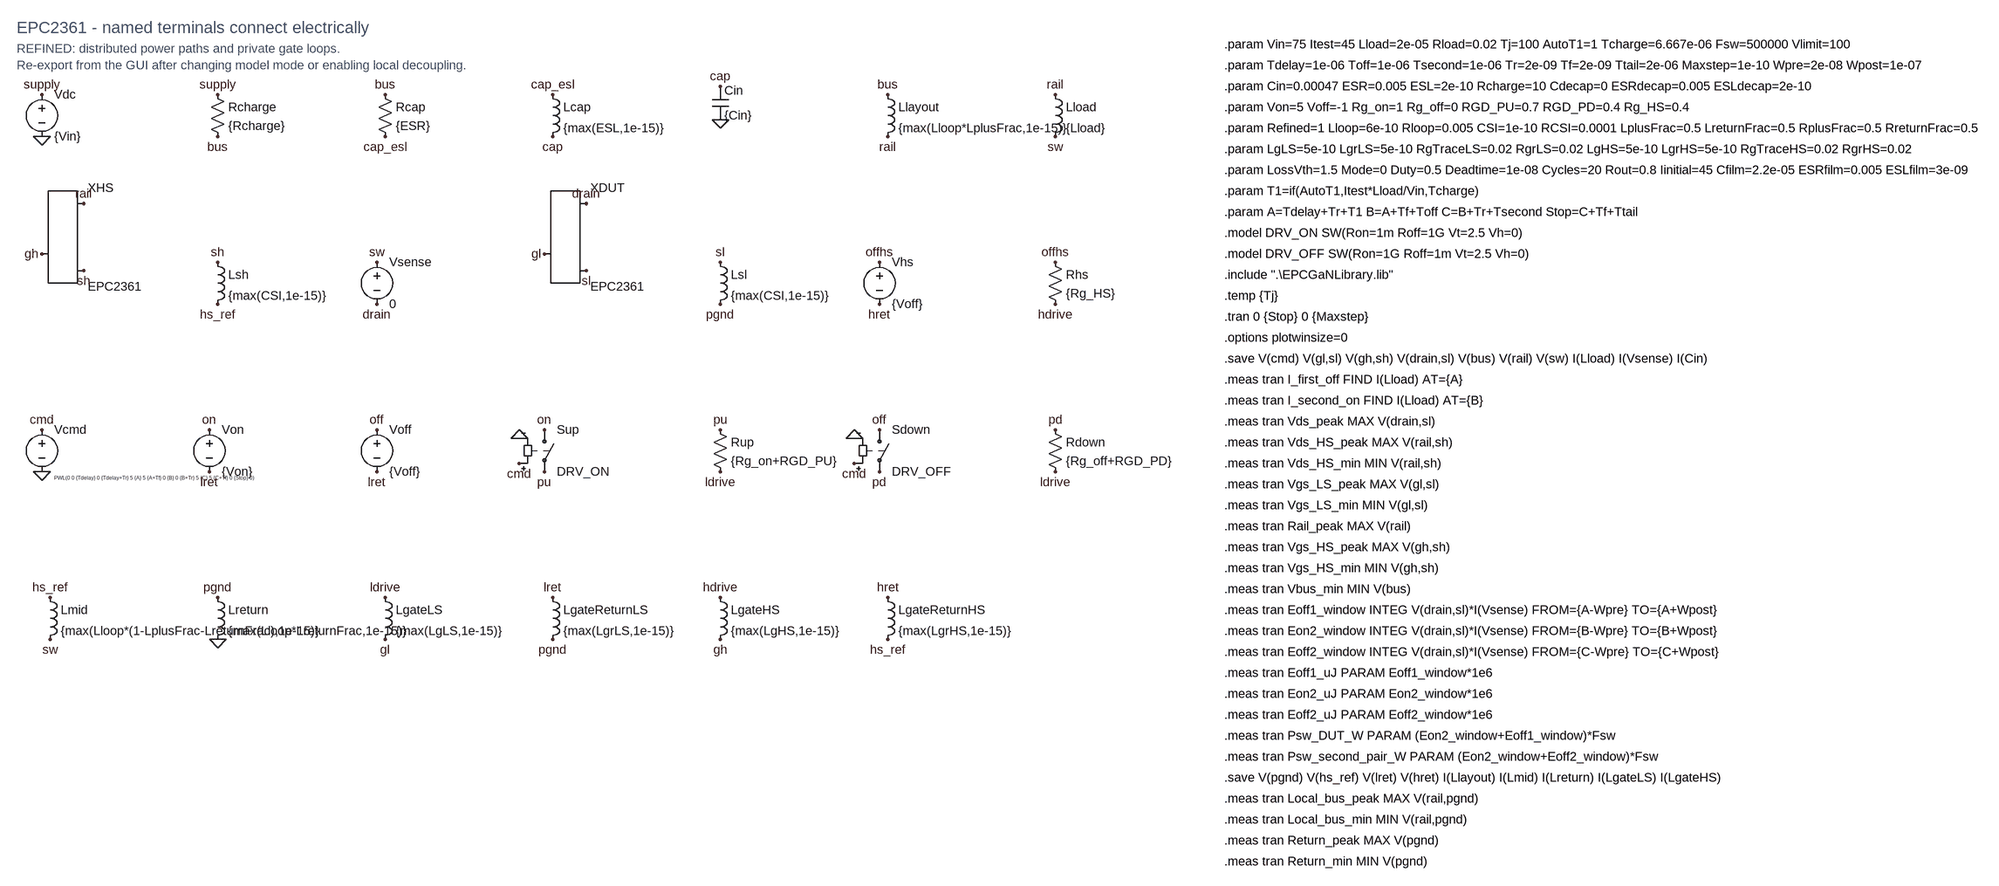
[diagram p0: schematic DPT-EPC.asc]
DPT-EPC.asc, the LTspice schematic file:
Version 4
SHEET 1 4400 2100
TEXT 48 0 Left 3 ;EPC2361 - named terminals connect electrically
TEXT 48 40 Left 2 ;REFINED: distributed power paths and private gate loops.
TEXT 48 72 Left 2 ;Re-export from the GUI after changing model mode or enabling local decoupling.
SYMBOL voltage 96 112 R0
SYMATTR InstName Vdc
SYMATTR Value {Vin}
FLAG 96 128 supply
FLAG 96 208 0
SYMBOL res 416 112 R0
SYMATTR InstName Rcharge
SYMATTR Value {Rcharge}
FLAG 432 128 supply
FLAG 432 208 bus
SYMBOL res 736 112 R0
SYMATTR InstName Rcap
SYMATTR Value {ESR}
FLAG 752 128 bus
FLAG 752 208 cap_esl
SYMBOL ind 1056 112 R0
SYMATTR InstName Lcap
SYMATTR Value {max(ESL,1e-15)}
SYMATTR SpiceLine Rser=0
FLAG 1072 128 cap_esl
FLAG 1072 208 cap
SYMBOL cap 1376 112 R0
SYMATTR InstName Cin
SYMATTR Value {Cin}
FLAG 1392 112 cap
FLAG 1392 176 0
SYMBOL ind 1696 112 R0
SYMATTR InstName Llayout
SYMATTR Value {max(Lloop*LplusFrac,1e-15)}
SYMATTR SpiceLine Rser={Rloop*RplusFrac}
FLAG 1712 128 bus
FLAG 1712 208 rail
SYMBOL ind 2016 112 R0
SYMATTR InstName Lload
SYMATTR Value {Lload}
SYMATTR SpiceLine Rser={Rload}
FLAG 2032 128 rail
FLAG 2032 208 sw
SYMBOL EPCGaN 96 432 R0
SYMATTR InstName XHS
SYMATTR Value EPC2361
SYMATTR ModelFile .\EPCGaNLibrary.lib
FLAG 96 432 gh
FLAG 176 336 rail
FLAG 176 464 sh
SYMBOL ind 416 432 R0
SYMATTR InstName Lsh
SYMATTR Value {max(CSI,1e-15)}
SYMATTR SpiceLine Rser={RCSI}
FLAG 432 448 sh
FLAG 432 528 hs_ref
SYMBOL voltage 736 432 R0
SYMATTR InstName Vsense
SYMATTR Value 0
FLAG 736 448 sw
FLAG 736 528 drain
SYMBOL EPCGaN 1056 432 R0
SYMATTR InstName XDUT
SYMATTR Value EPC2361
SYMATTR ModelFile .\EPCGaNLibrary.lib
FLAG 1056 432 gl
FLAG 1136 336 drain
FLAG 1136 464 sl
SYMBOL ind 1376 432 R0
SYMATTR InstName Lsl
SYMATTR Value {max(CSI,1e-15)}
SYMATTR SpiceLine Rser={RCSI}
FLAG 1392 448 sl
FLAG 1392 528 pgnd
SYMBOL voltage 1696 432 R0
SYMATTR InstName Vhs
SYMATTR Value {Voff}
FLAG 1696 448 offhs
FLAG 1696 528 hret
SYMBOL res 2016 432 R0
SYMATTR InstName Rhs
SYMATTR Value {Rg_HS}
FLAG 2032 448 offhs
FLAG 2032 528 hdrive
SYMBOL voltage 96 752 R0
WINDOW 3 24 108 Left 0
SYMATTR InstName Vcmd
SYMATTR Value PWL(0 0 {Tdelay} 0 {Tdelay+Tr} 5 {A} 5 {A+Tf} 0 {B} 0 {B+Tr} 5 {C} 5 {C+Tf} 0 {Stop} 0)
FLAG 96 768 cmd
FLAG 96 848 0
SYMBOL voltage 416 752 R0
SYMATTR InstName Von
SYMATTR Value {Von}
FLAG 416 768 on
FLAG 416 848 lret
SYMBOL voltage 736 752 R0
SYMATTR InstName Voff
SYMATTR Value {Voff}
FLAG 736 768 off
FLAG 736 848 lret
SYMBOL sw 1056 752 R0
SYMATTR InstName Sup
SYMATTR Value DRV_ON
FLAG 1056 768 on
FLAG 1056 848 pu
FLAG 1008 832 cmd
FLAG 1008 784 0
SYMBOL res 1376 752 R0
SYMATTR InstName Rup
SYMATTR Value {Rg_on+RGD_PU}
FLAG 1392 768 pu
FLAG 1392 848 ldrive
SYMBOL sw 1696 752 R0
SYMATTR InstName Sdown
SYMATTR Value DRV_OFF
FLAG 1696 768 off
FLAG 1696 848 pd
FLAG 1648 832 cmd
FLAG 1648 784 0
SYMBOL res 2016 752 R0
SYMATTR InstName Rdown
SYMATTR Value {Rg_off+RGD_PD}
FLAG 2032 768 pd
FLAG 2032 848 ldrive
SYMBOL ind 96 1072 R0
SYMATTR InstName Lmid
SYMATTR Value {max(Lloop*(1-LplusFrac-LreturnFrac),1e-15)}
SYMATTR SpiceLine Rser={Rloop*max(1-RplusFrac-RreturnFrac,0)}
FLAG 112 1088 hs_ref
FLAG 112 1168 sw
SYMBOL ind 416 1072 R0
SYMATTR InstName Lreturn
SYMATTR Value {max(Lloop*LreturnFrac,1e-15)}
SYMATTR SpiceLine Rser={Rloop*RreturnFrac}
FLAG 432 1088 pgnd
FLAG 432 1168 0
SYMBOL ind 736 1072 R0
SYMATTR InstName LgateLS
SYMATTR Value {max(LgLS,1e-15)}
SYMATTR SpiceLine Rser={RgTraceLS}
FLAG 752 1088 ldrive
FLAG 752 1168 gl
SYMBOL ind 1056 1072 R0
SYMATTR InstName LgateReturnLS
SYMATTR Value {max(LgrLS,1e-15)}
SYMATTR SpiceLine Rser={RgrLS}
FLAG 1072 1088 lret
FLAG 1072 1168 pgnd
SYMBOL ind 1376 1072 R0
SYMATTR InstName LgateHS
SYMATTR Value {max(LgHS,1e-15)}
SYMATTR SpiceLine Rser={RgTraceHS}
FLAG 1392 1088 hdrive
FLAG 1392 1168 gh
SYMBOL ind 1696 1072 R0
SYMATTR InstName LgateReturnHS
SYMATTR Value {max(LgrHS,1e-15)}
SYMATTR SpiceLine Rser={RgrHS}
FLAG 1712 1088 hret
FLAG 1712 1168 hs_ref
TEXT 2440 32 Left 2 !.param Vin=75 Itest=45 Lload=2e-05 Rload=0.02 Tj=100 AutoT1=1 Tcharge=6.667e-06 Fsw=500000 Vlimit=100
TEXT 2440 72 Left 2 !.param Tdelay=1e-06 Toff=1e-06 Tsecond=1e-06 Tr=2e-09 Tf=2e-09 Ttail=2e-06 Maxstep=1e-10 Wpre=2e-08 Wpost=1e-07
TEXT 2440 112 Left 2 !.param Cin=0.00047 ESR=0.005 ESL=2e-10 Rcharge=10 Cdecap=0 ESRdecap=0.005 ESLdecap=2e-10
TEXT 2440 152 Left 2 !.param Von=5 Voff=-1 Rg_on=1 Rg_off=0 RGD_PU=0.7 RGD_PD=0.4 Rg_HS=0.4
TEXT 2440 192 Left 2 !.param Refined=1 Lloop=6e-10 Rloop=0.005 CSI=1e-10 RCSI=0.0001 LplusFrac=0.5 LreturnFrac=0.5 RplusFrac=0.5 RreturnFrac=0.5
TEXT 2440 232 Left 2 !.param LgLS=5e-10 LgrLS=5e-10 RgTraceLS=0.02 RgrLS=0.02 LgHS=5e-10 LgrHS=5e-10 RgTraceHS=0.02 RgrHS=0.02
TEXT 2440 272 Left 2 !.param LossVth=1.5 Mode=0 Duty=0.5 Deadtime=1e-08 Cycles=20 Rout=0.8 Iinitial=45 Cfilm=2.2e-05 ESRfilm=0.005 ESLfilm=3e-09
TEXT 2440 312 Left 2 !.param T1=if(AutoT1,Itest*Lload/Vin,Tcharge)
TEXT 2440 352 Left 2 !.param A=Tdelay+Tr+T1 B=A+Tf+Toff C=B+Tr+Tsecond Stop=C+Tf+Ttail
TEXT 2440 392 Left 2 !.model DRV_ON SW(Ron=1m Roff=1G Vt=2.5 Vh=0)
TEXT 2440 432 Left 2 !.model DRV_OFF SW(Ron=1G Roff=1m Vt=2.5 Vh=0)
TEXT 2440 472 Left 2 !.include ".\EPCGaNLibrary.lib"
TEXT 2440 512 Left 2 !.temp {Tj}
TEXT 2440 552 Left 2 !.tran 0 {Stop} 0 {Maxstep}
TEXT 2440 592 Left 2 !.options plotwinsize=0
TEXT 2440 632 Left 2 !.save V(cmd) V(gl,sl) V(gh,sh) V(drain,sl) V(bus) V(rail) V(sw) I(Lload) I(Vsense) I(Cin)
TEXT 2440 672 Left 2 !.meas tran I_first_off FIND I(Lload) AT={A}
TEXT 2440 712 Left 2 !.meas tran I_second_on FIND I(Lload) AT={B}
TEXT 2440 752 Left 2 !.meas tran Vds_peak MAX V(drain,sl)
TEXT 2440 792 Left 2 !.meas tran Vds_HS_peak MAX V(rail,sh)
TEXT 2440 832 Left 2 !.meas tran Vds_HS_min MIN V(rail,sh)
TEXT 2440 872 Left 2 !.meas tran Vgs_LS_peak MAX V(gl,sl)
TEXT 2440 912 Left 2 !.meas tran Vgs_LS_min MIN V(gl,sl)
TEXT 2440 952 Left 2 !.meas tran Rail_peak MAX V(rail)
TEXT 2440 992 Left 2 !.meas tran Vgs_HS_peak MAX V(gh,sh)
TEXT 2440 1032 Left 2 !.meas tran Vgs_HS_min MIN V(gh,sh)
TEXT 2440 1072 Left 2 !.meas tran Vbus_min MIN V(bus)
TEXT 2440 1112 Left 2 !.meas tran Eoff1_window INTEG V(drain,sl)*I(Vsense) FROM={A-Wpre} TO={A+Wpost}
TEXT 2440 1152 Left 2 !.meas tran Eon2_window INTEG V(drain,sl)*I(Vsense) FROM={B-Wpre} TO={B+Wpost}
TEXT 2440 1192 Left 2 !.meas tran Eoff2_window INTEG V(drain,sl)*I(Vsense) FROM={C-Wpre} TO={C+Wpost}
TEXT 2440 1232 Left 2 !.meas tran Eoff1_uJ PARAM Eoff1_window*1e6
TEXT 2440 1272 Left 2 !.meas tran Eon2_uJ PARAM Eon2_window*1e6
TEXT 2440 1312 Left 2 !.meas tran Eoff2_uJ PARAM Eoff2_window*1e6
TEXT 2440 1352 Left 2 !.meas tran Psw_DUT_W PARAM (Eon2_window+Eoff1_window)*Fsw
TEXT 2440 1392 Left 2 !.meas tran Psw_second_pair_W PARAM (Eon2_window+Eoff2_window)*Fsw
TEXT 2440 1432 Left 2 !.save V(pgnd) V(hs_ref) V(lret) V(hret) I(Llayout) I(Lmid) I(Lreturn) I(LgateLS) I(LgateHS)
TEXT 2440 1472 Left 2 !.meas tran Local_bus_peak MAX V(rail,pgnd)
TEXT 2440 1512 Left 2 !.meas tran Local_bus_min MIN V(rail,pgnd)
TEXT 2440 1552 Left 2 !.meas tran Return_peak MAX V(pgnd)
TEXT 2440 1592 Left 2 !.meas tran Return_min MIN V(pgnd)

The netlist it stands for:
* DPT-EPC.asc
Vdc supply 0 {Vin}
Rcharge supply bus {Rcharge}
Rcap bus cap_esl {ESR}
Lcap cap_esl cap {max(ESL,1e-15)} Rser=0
Cin cap 0 {Cin}
Llayout bus rail {max(Lloop*LplusFrac,1e-15)} Rser={Rloop*RplusFrac}
Lload rail sw {Lload} Rser={Rload}
XXHS gh rail sh EPC2361
Lsh sh hs_ref {max(CSI,1e-15)} Rser={RCSI}
Vsense sw drain 0
XXDUT gl drain sl EPC2361
Lsl sl pgnd {max(CSI,1e-15)} Rser={RCSI}
Vhs offhs hret {Voff}
Rhs offhs hdrive {Rg_HS}
Vcmd cmd 0 PWL(0 0 {Tdelay} 0 {Tdelay+Tr} 5 {A} 5 {A+Tf} 0 {B} 0 {B+Tr} 5 {C} 5 {C+Tf} 0 {Stop} 0)
Von on lret {Von}
Voff off lret {Voff}
Sup on pu cmd 0 DRV_ON
Rup pu ldrive {Rg_on+RGD_PU}
Sdown off pd cmd 0 DRV_OFF
Rdown pd ldrive {Rg_off+RGD_PD}
Lmid hs_ref sw {max(Lloop*(1-LplusFrac-LreturnFrac),1e-15)} Rser={Rloop*max(1-RplusFrac-RreturnFrac,0)}
Lreturn pgnd 0 {max(Lloop*LreturnFrac,1e-15)} Rser={Rloop*RreturnFrac}
LgateLS ldrive gl {max(LgLS,1e-15)} Rser={RgTraceLS}
LgateReturnLS lret pgnd {max(LgrLS,1e-15)} Rser={RgrLS}
LgateHS hdrive gh {max(LgHS,1e-15)} Rser={RgTraceHS}
LgateReturnHS hret hs_ref {max(LgrHS,1e-15)} Rser={RgrHS}
* EPC2361 - named terminals connect electrically
* REFINED: distributed power paths and private gate loops.
* Re-export from the GUI after changing model mode or enabling local decoupling.
.param Vin=75 Itest=45 Lload=2e-05 Rload=0.02 Tj=100 AutoT1=1 Tcharge=6.667e-06 Fsw=500000 Vlimit=100
.param Tdelay=1e-06 Toff=1e-06 Tsecond=1e-06 Tr=2e-09 Tf=2e-09 Ttail=2e-06 Maxstep=1e-10 Wpre=2e-08 Wpost=1e-07
.param Cin=0.00047 ESR=0.005 ESL=2e-10 Rcharge=10 Cdecap=0 ESRdecap=0.005 ESLdecap=2e-10
.param Von=5 Voff=-1 Rg_on=1 Rg_off=0 RGD_PU=0.7 RGD_PD=0.4 Rg_HS=0.4
.param Refined=1 Lloop=6e-10 Rloop=0.005 CSI=1e-10 RCSI=0.0001 LplusFrac=0.5 LreturnFrac=0.5 RplusFrac=0.5 RreturnFrac=0.5
.param LgLS=5e-10 LgrLS=5e-10 RgTraceLS=0.02 RgrLS=0.02 LgHS=5e-10 LgrHS=5e-10 RgTraceHS=0.02 RgrHS=0.02
.param LossVth=1.5 Mode=0 Duty=0.5 Deadtime=1e-08 Cycles=20 Rout=0.8 Iinitial=45 Cfilm=2.2e-05 ESRfilm=0.005 ESLfilm=3e-09
.param T1=if(AutoT1,Itest*Lload/Vin,Tcharge)
.param A=Tdelay+Tr+T1 B=A+Tf+Toff C=B+Tr+Tsecond Stop=C+Tf+Ttail
.model DRV_ON SW(Ron=1m Roff=1G Vt=2.5 Vh=0)
.model DRV_OFF SW(Ron=1G Roff=1m Vt=2.5 Vh=0)
.include ".\EPCGaNLibrary.lib"
.temp {Tj}
.tran 0 {Stop} 0 {Maxstep}
.options plotwinsize=0
.save V(cmd) V(gl,sl) V(gh,sh) V(drain,sl) V(bus) V(rail) V(sw) I(Lload) I(Vsense) I(Cin)
.meas tran I_first_off FIND I(Lload) AT={A}
.meas tran I_second_on FIND I(Lload) AT={B}
.meas tran Vds_peak MAX V(drain,sl)
.meas tran Vds_HS_peak MAX V(rail,sh)
.meas tran Vds_HS_min MIN V(rail,sh)
.meas tran Vgs_LS_peak MAX V(gl,sl)
.meas tran Vgs_LS_min MIN V(gl,sl)
.meas tran Rail_peak MAX V(rail)
.meas tran Vgs_HS_peak MAX V(gh,sh)
.meas tran Vgs_HS_min MIN V(gh,sh)
.meas tran Vbus_min MIN V(bus)
.meas tran Eoff1_window INTEG V(drain,sl)*I(Vsense) FROM={A-Wpre} TO={A+Wpost}
.meas tran Eon2_window INTEG V(drain,sl)*I(Vsense) FROM={B-Wpre} TO={B+Wpost}
.meas tran Eoff2_window INTEG V(drain,sl)*I(Vsense) FROM={C-Wpre} TO={C+Wpost}
.meas tran Eoff1_uJ PARAM Eoff1_window*1e6
.meas tran Eon2_uJ PARAM Eon2_window*1e6
.meas tran Eoff2_uJ PARAM Eoff2_window*1e6
.meas tran Psw_DUT_W PARAM (Eon2_window+Eoff1_window)*Fsw
.meas tran Psw_second_pair_W PARAM (Eon2_window+Eoff2_window)*Fsw
.save V(pgnd) V(hs_ref) V(lret) V(hret) I(Llayout) I(Lmid) I(Lreturn) I(LgateLS) I(LgateHS)
.meas tran Local_bus_peak MAX V(rail,pgnd)
.meas tran Local_bus_min MIN V(rail,pgnd)
.meas tran Return_peak MAX V(pgnd)
.meas tran Return_min MIN V(pgnd)
.lib .\EPCGaNLibrary.lib
.backanno
.end